# EAGLE design trippling (EAGLE 9.4.2)
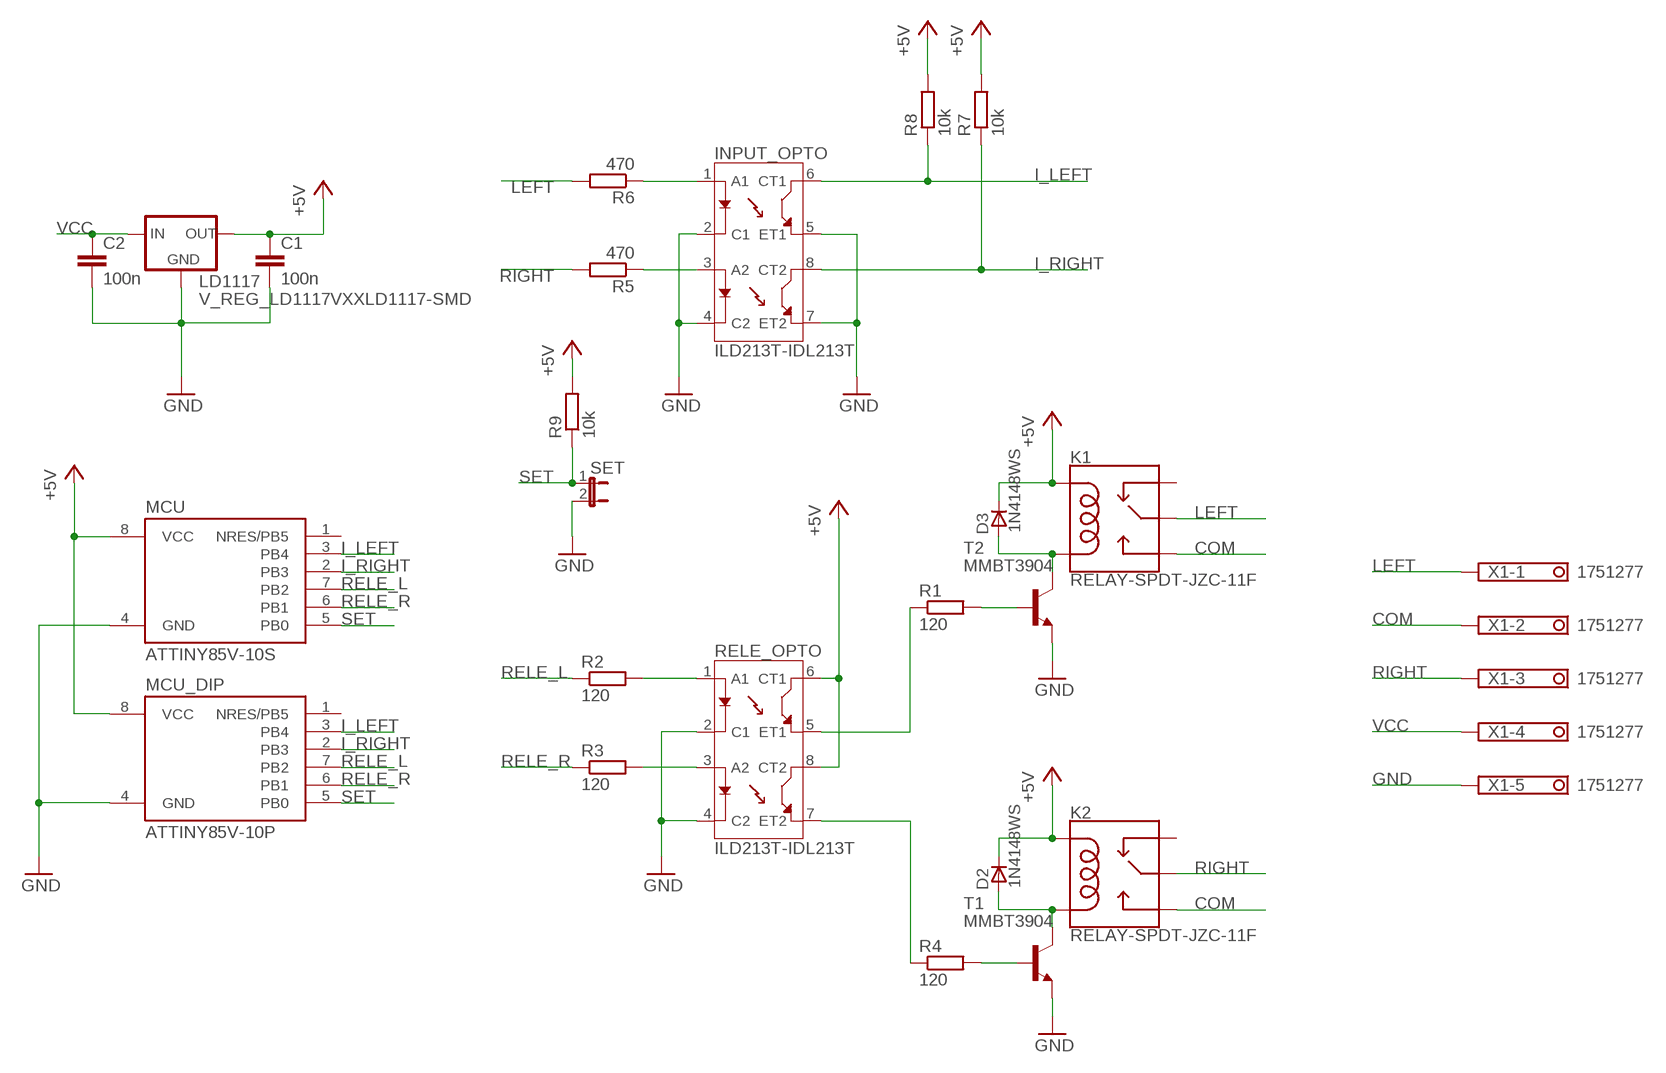
[diagram p0: schematic, sheet 1]

## Parts
C1  100n  C-EUC0805  [C0805]
C2  100n  C-EUC0805  [C0805]
D2  1N4148WS  [SOD323F]
D3  1N4148WS  [SOD323F]
INPUT_OPTO  ILD213T-IDL213T  [SO08]
K1  RELAY-SPDT-JZC-11F  [RELAY-JZC]
K2  RELAY-SPDT-JZC-11F  [RELAY-JZC]
LD1117  V_REG_LD1117VXXLD1117-SMD  [SOT223]
MCU  ATTINY85V-10S  [SOIC8_EIAJ_208MIL]
MCU_DIP  ATTINY85V-10P  [PDIP08_300MIL]
R1  120  R-EU_R0805  [R0805]
R2  120  R-EU_R0805  [R0805]
R3  120  R-EU_R0805  [R0805]
R4  120  R-EU_R0805  [R0805]
R5  470  R-EU_R0805  [R0805]
R6  470  R-EU_R0805  [R0805]
R7  10k  R-EU_R0805  [R0805]
R8  10k  R-EU_R0805  [R0805]
R9  10k  R-EU_R0805  [R0805]
RELE_OPTO  ILD213T-IDL213T  [SO08]
SET  JP1E  [JP1]
T1  MMBT3904  MMBT3904LT1-NPN-SOT23-BEC  [SOT23-BEC]
T2  MMBT3904  MMBT3904LT1-NPN-SOT23-BEC  [SOT23-BEC]
X1  1751277  [1751277]

## Nets
+5V: C1.1 D2.C D3.C K1.5(COIL1) K2.5(COIL1) LD1117.2(OUT) MCU.8(VCC) MCU_DIP.8(VCC) R7.2 R8.2 R9.2 RELE_OPTO.6(CT1) RELE_OPTO.8(CT2)
COM: K1.3(NO) K2.3(NO) X1.2
GND: C1.2 C2.2 INPUT_OPTO.2(C1) INPUT_OPTO.4(C2) INPUT_OPTO.5(ET1) INPUT_OPTO.7(ET2) LD1117.1(GND) MCU.4(GND) MCU_DIP.4(GND) RELE_OPTO.2(C1) RELE_OPTO.4(C2) SET.2 T1.E T2.E X1.5
I_LEFT: INPUT_OPTO.6(CT1) MCU.3(PB4) MCU_DIP.3(PB4) R8.1
I_RIGHT: INPUT_OPTO.8(CT2) MCU.2(PB3) MCU_DIP.2(PB3) R7.1
LEFT: K1.4(MAIN) R6.2 X1.1
N$1: INPUT_OPTO.1(A1) R6.1
N$2: INPUT_OPTO.3(A2) R5.1
N$18: D3.A K1.1(COIL2) T2.C
N$19: R1.2 T2.B
N$20: R4.2 T1.B
N$21: D2.A K2.1(COIL2) T1.C
N$22: R1.1 RELE_OPTO.5(ET1)
N$23: R4.1 RELE_OPTO.7(ET2)
N$24: R3.2 RELE_OPTO.3(A2)
N$25: R2.2 RELE_OPTO.1(A1)
RELE_L: MCU.7(PB2) MCU_DIP.7(PB2) R2.1
RELE_R: MCU.6(PB1) MCU_DIP.6(PB1) R3.1
RIGHT: K2.4(MAIN) R5.2 X1.3
SET: MCU.5(PB0) MCU_DIP.5(PB0) R9.1 SET.1
VCC: C2.1 LD1117.3(IN) X1.4
Unconnected: K1.2(NC) K2.2(NC) MCU.1(NRES/PB5) MCU_DIP.1(NRES/PB5)

## Library data of the parts
C1 C2 = resistor:C-EU: CAPACITOR, European symbol
D2 D3 = _hhn_diodes_smd:1N4148WS: 1N4148 General Purpose Rectifie SMD-Version of 1N4148 Case: SOD 323 F Author: Dipl.-Ing. FH Rainer Bayer HHN Hochschule Heilbronn, rainer.bayer@hs-heilbronn.de Ingenieurbüro ing-rb, mail@ing-rb.de
INPUT_OPTO RELE_OPTO = SparkFun-DiscreteSemi:ILD213T: Dual Channel Phototransistor Optocoupler Dual Channel 70 V 4000 Vrms Phototransistor Optocoupler in a standard SOIC-8 package. Used to couple signals between electrically isolated circuits. Datasheet <https://www.sparkfun.com/datasheets/Components/SMD/ild205t.pdf> SparkFun Products: SparkFun Opto-Isolator Breakout <https://www.sparkfun.com/products/9118>; PROD_ID: IC-09076
K1 K2 = SparkFun-Electromechanical:RELAY-SPDT: SPDT Electromechanical Relay Single-pole, double-throw sealed relays. When current is applied to the coil, it throws a simple changeover switch, terminating the connection from the NC contact to ground and closing the NO contact. Use them to switch high voltage/high current devices. SparkFun Products JQX-15F: Relay SPDT Sealed - 20A <https://www.sparkfun.com/products/10924> (COM-10924) JZC-11F: Relay SPDT Sealed <https://www.sparkfun.com/products/100> (COM-00100); PROD_ID: COMP-09533; SF_SKU: COM-00100
LD1117 = SparkFun-IC-Power:V_REG_LD1117VXX: LD1117VXX voltage regulator. We carry the 3.3V version (COM-00526) in TO-220 package.; PROD_ID: VREG-13917
MCU MCU_DIP = _hhn_attiny25_45_85:ATTINY85*: ATMEL ATtiny 85 Packages: P = PDIP 08 30mil S = SOIC 08 EIAJ 208mil Technologies Note: for complete ordering code (temp. range, finish, tape&reel etc.) see www.atmel.com • Supply Voltage: V = (1.8…5.5)V | [blank] = (2.7…5.5)V • Speed: 10 = 10 MHz | 20 = 20 MHz Author: Dipl.-Ing. FH Rainer Bayer HHN Hochschule Heilbronn (Heilbronn University), rainer.bayer@hs-heilbronn.de Ingenieurbüro ing-rb, mail@ing-rb.de
R1-R9 = resistor:R-EU_: RESISTOR, European symbol
SET = jumper:JP1E: JUMPER
T1 T2 = transistor:*-NPN-: NPN Transistror BF959 corrected 2008.03.06
X1 = con-phoenix-350:1751277: MKDS 1/ 5-3,5 Printklemme Nennstrom: 10 A Bemessungsspannung: 160 V Raster: 3,5 mm Polzahl: 5 Montageart: Löten Anschlussart: Schraubanschluss Anschlussrichtung vom Leiter zur Platine: 0° Source: http://eshop.phoenixcontact.com .. 1751277.pdf; OC_FARNELL: unknown; OC_NEWARK: unknown

## Board
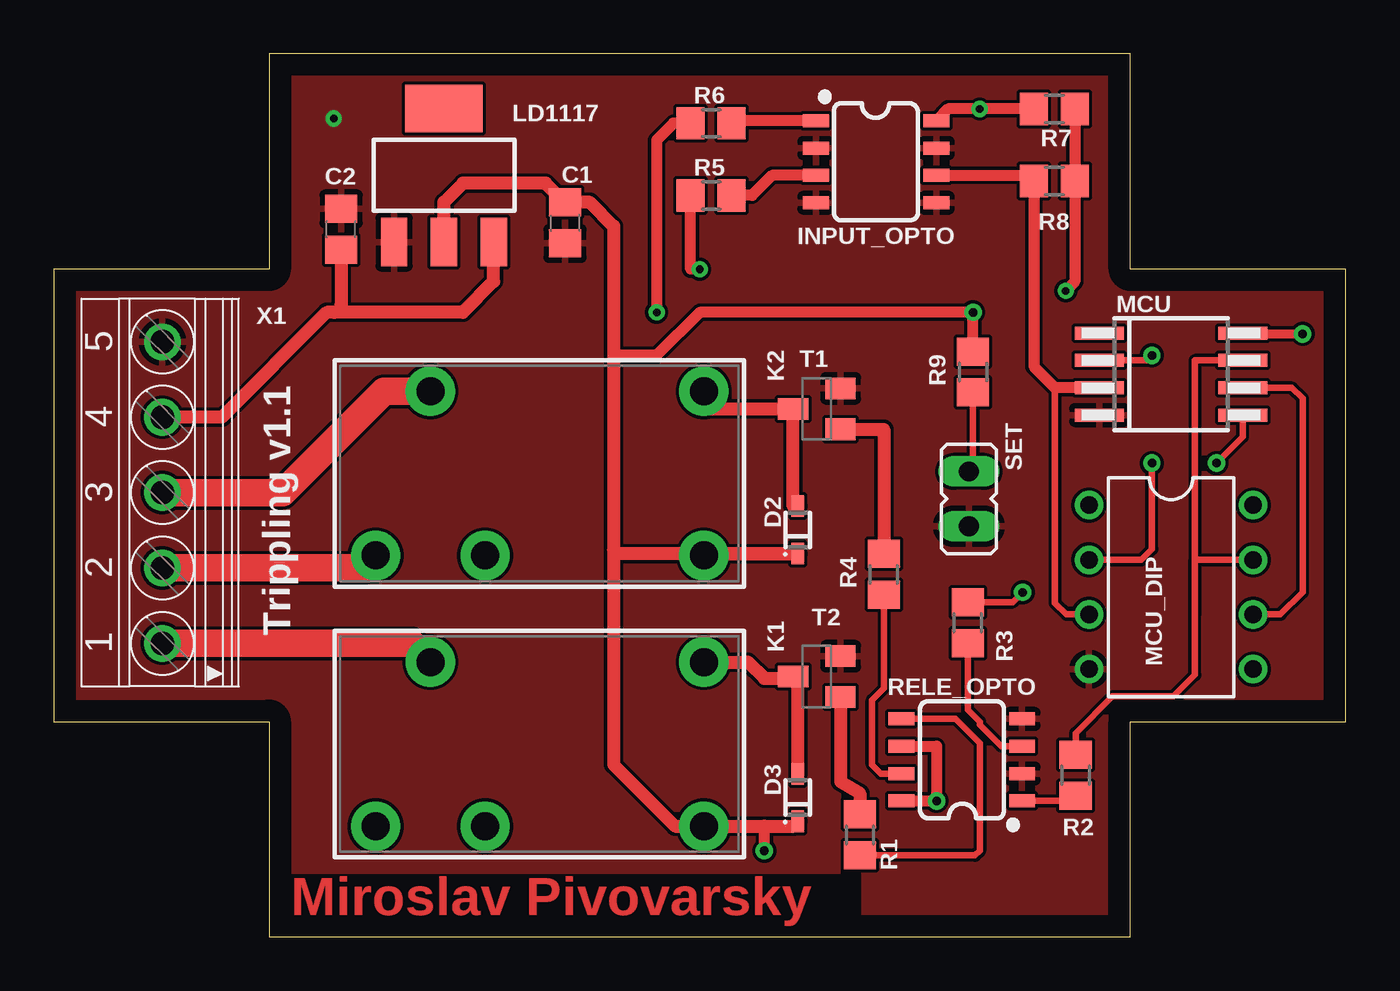
[diagram p1: board, top side]
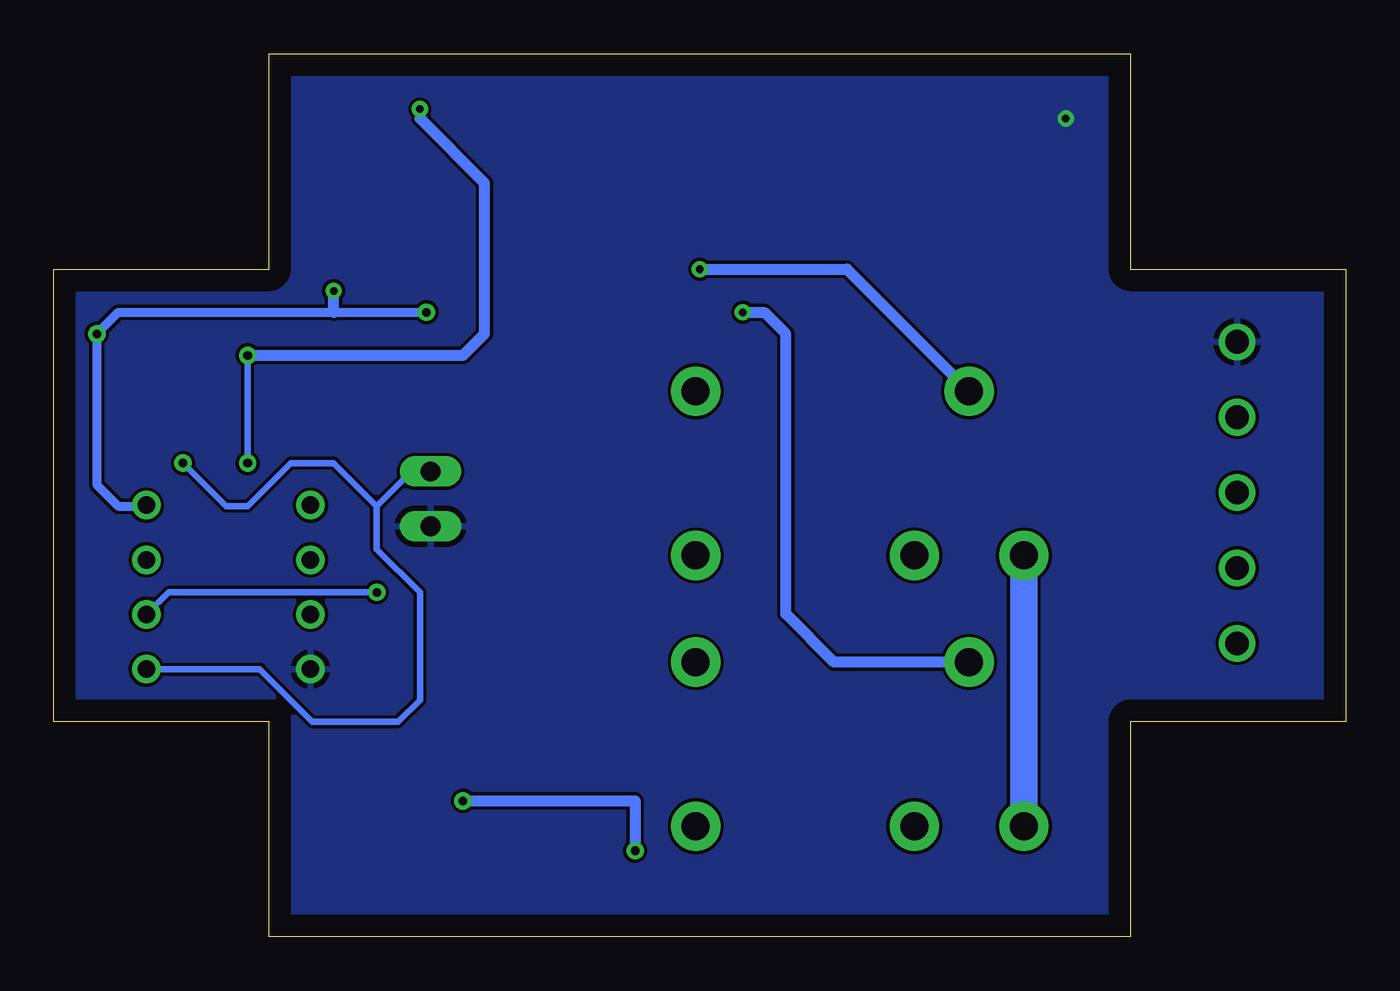
[diagram p2: board, bottom side, seen from below]

Size 60 x 41 mm. Coordinates in mm from the lower left corner, seen from the top.
Outline: 10,0 50,0 50,10 60,10 60,31 50,31 50,41 10,41 10,31 0,31 0,10 10,10 10,0
Copper layers (1*16): Top 0.035mm / dielectric 1.5mm / Bottom 0.035mm
Design rules "default": minimum track width 6mil, minimum drill 0.35mm, track to track 6mil, track to pad 6mil, pad to pad 6mil, via to via 6mil, smd to smd 6mil, copper to edge 40mil, drill to drill 6mil, minimum pad ring 10mil, minimum via ring 8mil, stop-mask expansion 4mil, vias tented up to drill 0mil, thermal gap 10mil

### Footprints (pad centres in the part's own frame; a part is rotated, then mirrored left to right if it is on the bottom)
C0805 = smd 1.3 x 1.5: 1 -0.95,0; 2 0.95,0
SOD323F = smd 1 x 0.6: A 1.1,0; C -1.1,0
SO08 = smd 0.6 x 1.2: 1 -1.905,-2.8; 2 -0.635,-2.8; 3 0.635,-2.8; 4 1.905,-2.8; 5 1.905,2.8; 6 0.635,2.8; 7 -0.635,2.8; 8 -1.905,2.8
RELAY-JZC = drill 1.3 pad 2.286: 1 3.81,-8.89; 2 -3.81,1.27; 3 -3.81,6.35; 4 3.81,3.81; 5 -3.81,-8.89
SOT223 = smd 1.219 x 2.235: 1 -2.311,-3.099; 2 0,-3.099; 3 2.311,-3.099 | smd 3.6 x 2.2: 4 0,3.099
SOIC8_EIAJ_208MIL = smd 0.6 x 2.286: 1 -1.905,-3.33; 2 -0.635,-3.33; 3 0.635,-3.33; 4 1.905,-3.33; 5 1.905,3.33; 6 0.635,3.33; 7 -0.635,3.33; 8 -1.905,3.33
PDIP08_300MIL = drill 0.813: 1 -3.81,-3.81; 2 -1.27,-3.81; 3 1.27,-3.81; 4 3.81,-3.81; 5 3.81,3.81; 6 1.27,3.81; 7 -1.27,3.81; 8 -3.81,3.81
R0805 = smd 1.3 x 1.5: 1 -0.95,0; 2 0.95,0
JP1 = drill 0.914 long: 1 0,-1.27; 2 0,1.27
SOT23-BEC = smd 1 x 1.4: B -0.95,-1.1; C 0,1.1; E 0.95,-1.1
1751277 = drill 1.1 pad 1.7: 1 -7,-0.1; 2 -3.5,-0.1; 3 0,-0.1; 4 3.5,-0.1; 5 7,-0.1

### Placement (x,y rotation side)
C1  23.74,33.15 270 top
C2  13.34,32.85 90 top
D2  34.55,18.9 90 top
D3  34.55,6.47 90 top
INPUT_OPTO  38.19,35.99 270 top
K1  21.3,8.95 90 top
K2  21.3,21.52 90 top
LD1117  18.12,35.36 0 top
MCU  51.89,26.13 270 top
MCU_DIP  51.89,16.24 270 top
R1  37.44,4.74 90 top
R2  47.45,7.51 270 top
R3  42.45,14.59 270 top
R4  38.55,16.83 90 top
R5  30.53,34.43 180 top
R6  30.53,37.78 180 top
R7  46.47,38.44 0 top
R8  46.47,35.09 0 top
R9  42.69,26.23 90 top
RELE_OPTO  42.17,8.22 90 top
SET  42.5,20.34 180 top
T1  35.44,24.52 90 top
T2  35.44,12.09 90 top
X1  4.94,20.63 90 top

### Tracks (layer width: path | path; a pad name or v marks a point on that pad's centre or on a via)
+5V  (via drill 0.35, 0.4)
  Top 0.406: MCU.8 55.26,28 v58,28
  Top 0.508: RELE_OPTO.6 41,8.86 v41,6.32 RELE_OPTO.8 | v33,4 33,5.14 | R9.2 v42.69,29 30,29 28,27 26,27 | 26,32.56 26,32 | R7.2 R8.2 47.42,30.42 v47,30
  Top 0.61: LD1117.2 18.12,34.12 19,35 22.84,35 C1.1 24.9,34.1 26,33 26,32 26,27 26,18 | D3.C arc-90 34.32,5.14 33,5.14 K1.5 28.86,5.14 26,8 26,18 | K2.5 30.19,17.8 D2.C 26.2,17.8 arc-90 26,18
  Bottom 0.406: MCU_DIP.8 55.75,20 57,20 58,21 v58,28 57,29 47,29 v42.69,29
  Bottom 0.508: v41,6.32 33,6.32 v33,4 | 47,29 v47,30
COM
  Top 1.27: X1.2 14.37,17.13 K2.3
  Bottom 1.27: K1.3 K2.3
GND  (via drill 0.35)
  other vias: 13,38
  pour Top: 10,41 50,41 50,31 60,31 60,10 50,10 50,0 10,0 10,10 0,10 0,31 10,31
  pour Bottom: 10,41 50,41 50,31 60,31 60,10 50,10 50,0 10,0 10,10 0,10 0,31 10,31
I_LEFT
  Top 0.305: 46.51,25.5 46.5,25.5 46.5,15.5 47.03,14.97 MCU_DIP.3
  Top 0.508: 46.5,25.5 45.52,26.48 R8.1 45.26,35.35 INPUT_OPTO.6 | MCU.3 46.51,25.5
I_RIGHT  (via drill 0.35, 0.4)
  Top 0.305: MCU.2 50.77,26.77 v51,27 | MCU_DIP.2 50.51,17.51 51,18 v51,22
  Top 0.508: R7.1 v43,38.44 41.53,38.44 INPUT_OPTO.8
  Bottom 0.305: v51,22 v51,27
  Bottom 0.508: v51,27 41,27 40,28 40,35 43,38 v43,38.44
LEFT  (via drill 0.35)
  Top 0.508: R6.2 28.78,37.78 28,37 v28,29
  Top 1.27: X1.1 16.62,13.63 K1.4
  Bottom 0.508: K1.4 23.76,12.76 26,15 26,28 27,29 v28,29
N$1
  Top 0.508: INPUT_OPTO.1 31.59,37.9 R6.1
N$2
  Top 0.508: INPUT_OPTO.3 33.35,35.35 32.43,34.43 R5.1
N$18
  Top 0.61: K1.1 32.24,12.76 33,12 34.25,12 T2.C 34.55,11.88 D3.A
N$19
  Top 0.61: T2.B 36.54,7.21 37.44,6.66 R1.2
N$20
  Top 0.61: T1.B 38.55,23.57 R4.2
N$21
  Top 0.61: D2.A 34.34,20 T1.C 30.19,24.52 K2.1
N$22
  Top 0.305: RELE_OPTO.5 41.88,10.12 43,9 43,4 42.79,3.79 R1.1
N$23
  Top 0.305: R4.1 38.55,11.55 38,11 38,8 38.41,7.58 RELE_OPTO.7
N$24
  Top 0.305: RELE_OPTO.3 44,8.86 43,9.86 43,10 42.45,10.55 R3.2
N$25
  Top 0.305: RELE_OPTO.1 47.2,6.32 R2.2
RELE_L
  Top 0.305: R2.1 47.46,9.46 49.17,11.17 52,11.17 53,12.17 53,15 | MCU_DIP.7 53,17.51 53,15 | MCU.7 53,26.77 53,15
RELE_R  (via drill 0.4)
  Top 0.305: R3.1 44.54,15.54 v45,16 | MCU_DIP.6 56.97,14.97 58,16 58,25 57.51,25.5 MCU.6
  Bottom 0.305: MCU_DIP.6 54.67,16 v45,16
RIGHT  (via drill 0.35)
  Top 0.508: v30,31 29.58,31 R5.2
  Top 1.27: X1.3 10.63,20.63 15.33,25.33 K2.4
  Bottom 0.508: K2.4 23.16,31 v30,31
SET  (via drill 0.4)
  Top 0.305: R9.1 42.69,21.8 SET.1 | v54,22 55.22,23.22 MCU.5
  Bottom 0.305: MCU_DIP.5 50.43,12.43 48,10 44,10 43,11 43,16 45,18 45,20 | 45,20 43.39,21.61 SET.1 | 45,20 | 45,20 47,22 49,22 51,20 52,20 v54,22
VCC
  Top 0.61: LD1117.3 20.43,30.43 19,29 13,29 | X1.4 7.81,24.13 12.68,29 13,29 | C2.1 13.34,29.34 arc-90 13,29

### Text on the board
Top: Miroslav Pivovarsky
tPlace: Trippling v1.1